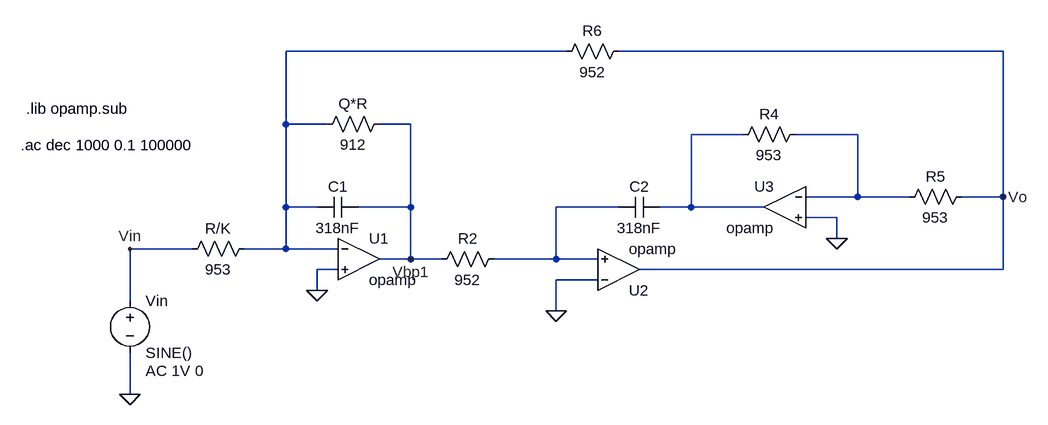
[diagram p0: schematic Ejercicio_Chebyshev.asc]
Ejercicio_Chebyshev.asc, the LTspice schematic file:
Version 4
SHEET 1 2684 1156
WIRE 592 -240 160 -240
WIRE 1264 -240 672 -240
WIRE 160 -128 160 -240
WIRE 224 -128 160 -128
WIRE 352 -128 304 -128
WIRE 864 -112 784 -112
WIRE 1040 -112 944 -112
WIRE 1040 -16 1040 -112
WIRE 1040 -16 960 -16
WIRE 1120 -16 1040 -16
WIRE 1264 -16 1264 -240
WIRE 1264 -16 1200 -16
WIRE 160 0 160 -128
WIRE 208 0 160 0
WIRE 352 0 352 -128
WIRE 352 0 272 0
WIRE 672 0 576 0
WIRE 784 0 784 -112
WIRE 784 0 736 0
WIRE 896 0 784 0
WIRE 1008 16 960 16
WIRE 1008 48 1008 16
WIRE 16 64 -80 64
WIRE 160 64 160 0
WIRE 160 64 96 64
WIRE 240 64 160 64
WIRE 352 80 352 0
WIRE 352 80 304 80
WIRE 400 80 352 80
WIRE 576 80 576 0
WIRE 576 80 480 80
WIRE 640 80 576 80
WIRE 240 96 208 96
WIRE 1264 96 1264 -16
WIRE 1264 96 704 96
WIRE 640 112 576 112
WIRE 208 128 208 96
WIRE -80 144 -80 64
WIRE 576 160 576 112
WIRE -80 288 -80 224
FLAG 208 128 0
FLAG 576 160 0
FLAG -80 288 0
FLAG 1008 48 0
FLAG -80 64 Vin
FLAG 352 80 Vbp1
FLAG 1264 -16 Vo
SYMBOL voltage -80 128 R0
WINDOW 123 24 124 Left 2
WINDOW 39 0 0 Left 0
SYMATTR Value2 AC 1V 0
SYMATTR InstName Vin
SYMATTR Value SINE()
SYMBOL res 112 48 R90
WINDOW 0 0 56 VBottom 2
WINDOW 3 32 56 VTop 2
SYMATTR InstName R/K
SYMATTR Value 953
SYMBOL cap 272 -16 R90
WINDOW 0 0 32 VBottom 2
WINDOW 3 32 32 VTop 2
SYMATTR InstName C1
SYMATTR Value 318nF
SYMBOL Opamps\\opamp 272 16 R0
SYMATTR InstName U1
SYMBOL res 496 64 R90
WINDOW 0 0 56 VBottom 2
WINDOW 3 32 56 VTop 2
SYMATTR InstName R2
SYMATTR Value 952
SYMBOL res 320 -144 R90
WINDOW 0 0 56 VBottom 2
WINDOW 3 32 56 VTop 2
SYMATTR InstName Q*R
SYMATTR Value 912
SYMBOL cap 736 -16 R90
WINDOW 0 0 32 VBottom 2
WINDOW 3 32 32 VTop 2
SYMATTR InstName C2
SYMATTR Value 318nF
SYMBOL Opamps\\opamp 672 160 M180
SYMATTR InstName U2
SYMBOL res 960 -128 R90
WINDOW 0 0 56 VBottom 2
WINDOW 3 32 56 VTop 2
SYMATTR InstName R4
SYMATTR Value 953
SYMBOL Opamps\\opamp 928 -64 M0
SYMATTR InstName U3
SYMBOL res 1216 -32 R90
WINDOW 0 0 56 VBottom 2
WINDOW 3 32 56 VTop 2
SYMATTR InstName R5
SYMATTR Value 953
SYMBOL res 688 -256 R90
WINDOW 0 0 56 VBottom 2
WINDOW 3 32 56 VTop 2
SYMATTR InstName R6
SYMATTR Value 952
TEXT -248 -96 Left 2 !.ac dec 1000 0.1 100000
TEXT -240 -152 Left 2 !.lib opamp.sub

The netlist it stands for:
* Ejercicio_Chebyshev.asc
Vin Vin 0 SINE() AC 1V 0
R/K N001 Vin 953
C1 Vbp1 N001 318nF
XU1 N001 0 Vbp1 opamp Aol=100K GBW=10Meg  ; pins invin noninvin out
R2 N004 Vbp1 952
R§Q*R Vbp1 N001 912
C2 N002 N004 318nF
XU2 0 N004 Vo opamp Aol=100K GBW=10Meg  ; pins invin noninvin out
R4 N003 N002 953
XU3 N003 0 N002 opamp Aol=100K GBW=10Meg  ; pins invin noninvin out
R5 Vo N003 953
R6 Vo N001 952
.ac dec 1000 0.1 100000
.lib opamp.sub
.backanno
.end